# Altium project Rev_2.0.PrjPcb
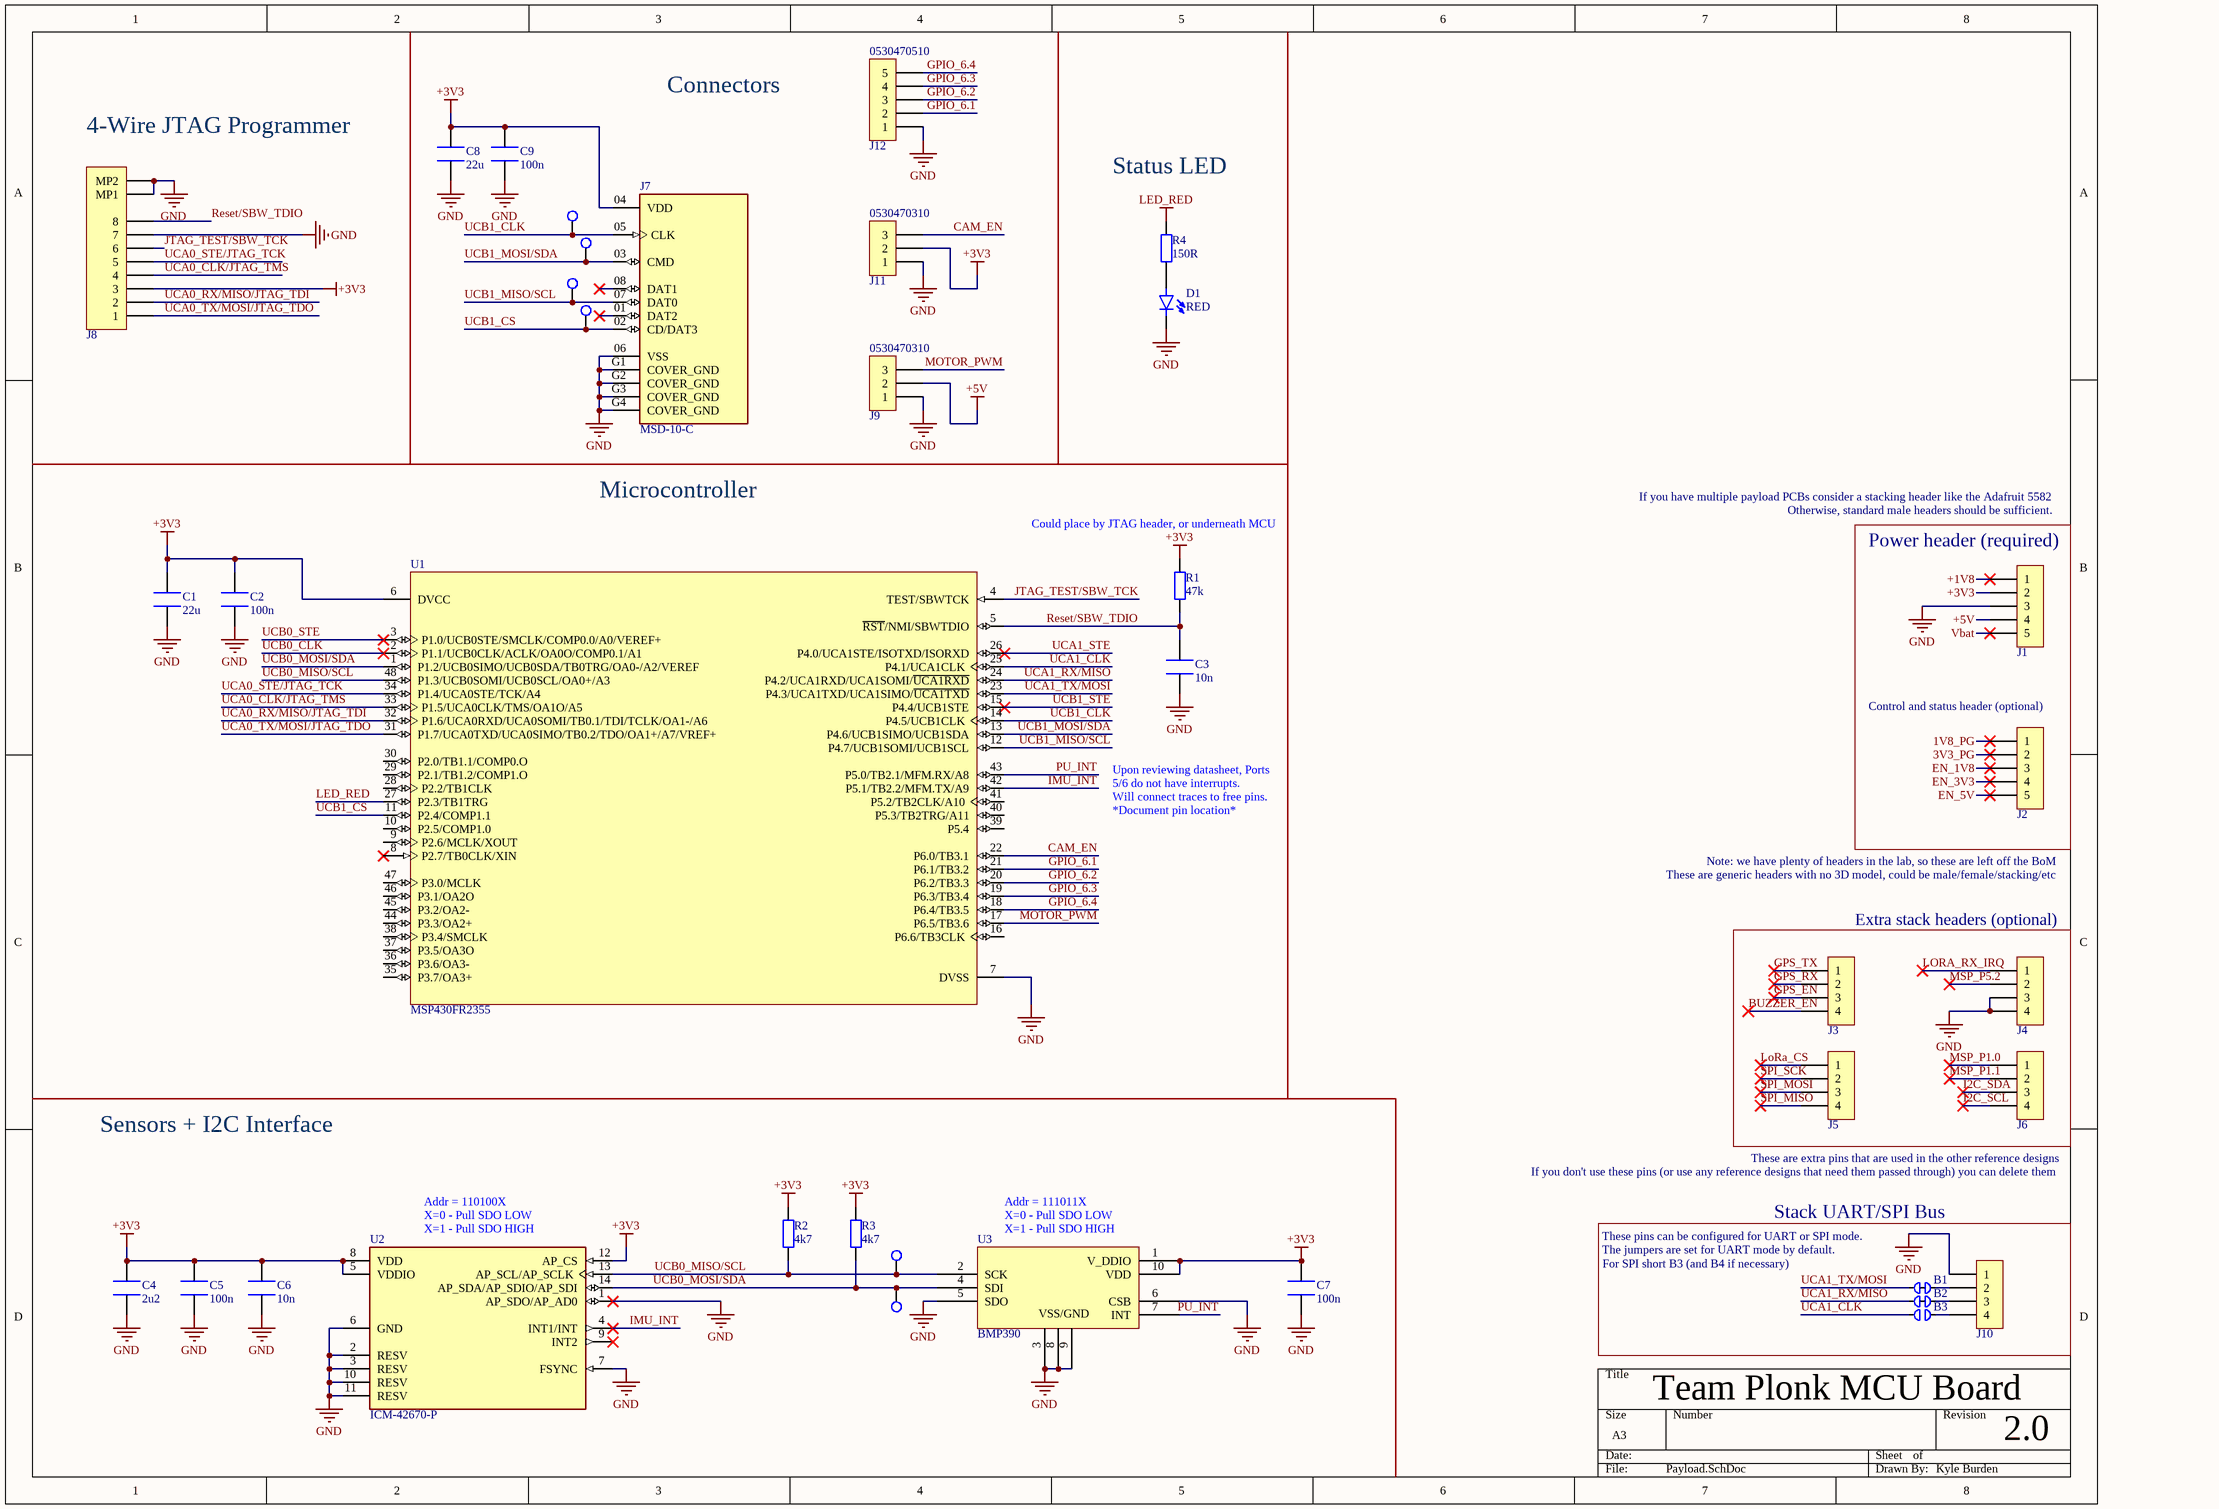
[diagram p0: Payload.SchDoc]
1 sheet, 38 parts. Net scope: global (net labels, ports and power ports of the same name join across sheets).
Board file: Payload.PcbDoc

## Sheet Payload.SchDoc
size A3; SheetNumber: 1; SheetTotal: 1

### Parts
B1  Solder Jumper Normally Closed  [Solder Bridge Chevron 0402 Closed]  (value not drawn)  (net tie, no BOM)
B2  Solder Jumper Normally Closed  [Solder Bridge Chevron 0402 Closed]  (value not drawn)  (net tie, no BOM)
B3  Solder Jumper Normally Open  [Solder Bridge Chevron 0402 Open]  (value not drawn)  (no BOM)
C1  22u  [CAPACITOR_0805_2012M-70N]
C2  100n  [CAPACITOR_0805_2012M-70N]
C3  10n  [CAPACITOR_0805_2012M-70N]
C4  2u2  [CAPACITOR_0805_2012M-70N]
C5  100n  [CAPACITOR_0805_2012M-70N]
C6  10n  [CAPACITOR_0805_2012M-70N]
C7  100n  [CAPACITOR_0805_2012M-70N]
C8  22u  [CAPACITOR_0805_2012M-70N]
C9  100n  [CAPACITOR_0805_2012M-70N]
D1  Colour: RED  [LED_0603_1608M_0.80mm]  (hidden comment: LTST-C190 Series)
J1  Header - 2.54mm,1x5-pin  [HEADER_2.54MM_1x5PIN]  (value not drawn)  (no BOM)
J2  Header - 2.54mm,1x5-pin  [HEADER_2.54MM_1x5PIN]  (value not drawn)  (no BOM)
J3  Header - 2.54mm,1x4-pin  [HEADER_2.54MM_1x4PIN]  (value not drawn)  (no BOM)
J4  Header - 2.54mm,1x4-pin  [HEADER_2.54MM_1x4PIN]  (value not drawn)  (no BOM)
J5  Header - 2.54mm,1x4-pin  [HEADER_2.54MM_1x4PIN]  (value not drawn)  (no BOM)
J6  Header - 2.54mm,1x4-pin  [HEADER_2.54MM_1x4PIN]  (value not drawn)  (no BOM)
J7  MSD-10-C  [MSD-10-C]
J8  0532610871  [MOLEX_0532610871]  (value not drawn)
J9  0530470310  [MOLEX_0530470310]
J10  HDR,2.54mm,1x4  [HEADER_2.54MM_1x4PIN]  (value not drawn)  (no BOM)
J11  0530470310  [MOLEX_0530470310]
J12  0530470510  [MOLEX_0530470510]
R1  47k  [RESISTOR_0805_2012M-50N]
R2  4k7  [RESISTOR_0805_2012M-50N]
R3  4k7  [RESISTOR_0805_2012M-50N]
R4  150R  [Resistor_0805_2012M-50N]
TP1  Test Point  [Test Point Pad Medium]  (value not drawn)  (no BOM)
TP2  Test Point  [Test Point Pad Medium]  (value not drawn)  (no BOM)
TP3  Test Point  [Test Point Pad Medium]  (value not drawn)  (no BOM)
TP4  Test Point  [Test Point Pad Medium]  (value not drawn)  (no BOM)
TP5  Test Point  [Test Point Pad Medium]  (value not drawn)  (no BOM)
TP6  Test Point  [Test Point Pad Medium]  (value not drawn)  (no BOM)
U1  MSP430FR2355  [PT0048A_N]
U2  ICM-42670-P  [XDCR_ICM-42670-P-EXTENDED_PADS]
U3  BMP390  [BMP390]

### Blocks framed on the sheet
Power header (required): J1 J2
Extra stack headers (optional): J3-J6
Stack UART/SPI Bus: B1-B3 J10

### Nets
+3V3: C1.2 C2.2 C4.2 C5.2 C6.2 C7.2 C8.2 C9.2 J1.2 J7.04(VDD) J8.3 J11.2 R1.2 R2.2 R3.2 U1.6(DVCC) U2.5(VDDIO) U2.8(VDD) U2.12(AP_CS) U3.1(V_DDIO) U3.10(VDD)
+5V: J1.4 J9.2
GND: C1.1 C2.1 C3.1 C4.1 C5.1 C6.1 C7.1 C8.1 C9.1 D1.C J1.3 J4.3 J4.4 J7.06(VSS) J7.G1(COVER_GND) J7.G2(COVER_GND) J7.G3(COVER_GND) J7.G4(COVER_GND) J8.7 J8.MP1 J8.MP2 J9.1 J10.1 J11.1 J12.1 U1.7(DVSS) U2.1(AP_SDO/AP_AD0) U2.2(RESV) U2.3(RESV) U2.6(GND) U2.7(FSYNC) U2.10(RESV) U2.11(RESV) U3.3(V_SS/GND) U3.5(SDO) U3.6(CSB) U3.8(V_SS/GND) U3.9(V_SS/GND)
LED_RED: R4.2 U1.27(P2.3/TB1TRG)
1V8_PG: J2.1
3V3_PG: J2.2
+1V8: J1.1
BUZZER_EN: J3.4
CAM_EN: J11.3 U1.22(P6.0/TB3.1)
EN_1V8: J2.3
EN_3V3: J2.4
EN_5V: J2.5
GPIO_6.1: J12.2 U1.21(P6.1/TB3.2)
GPIO_6.2: J12.3 U1.20(P6.2/TB3.3)
GPIO_6.3: J12.4 U1.19(P6.3/TB3.4)
GPIO_6.4: J12.5 U1.18(P6.4/TB3.5)
GPS_EN: J3.3
GPS_RX: J3.2
GPS_TX: J3.1
I2C_SCL: J6.4
I2C_SDA: J6.3
IMU_INT: U1.42(P5.1/TB2.2/MFM.TX/A9) U2.4(INT1/INT)
JTAG_TEST/SBW_TCK: J8.6 U1.4(TEST/SBWTCK)
LoRa_CS: J5.1
LORA_RX_IRQ: J4.1
MOTOR_PWM: J9.3 U1.17(P6.5/TB3.6)
MSP_P1.0: J6.1
MSP_P1.1: J6.2
MSP_P5.2: J4.2
PU_INT: U1.43(P5.0/TB2.1/MFM.RX/A8) U3.7(INT)
Reset/SBW_TDIO: C3.2 J8.8 R1.1 U1.5(~{RST}/NMI/SBWTDIO)
SPI_MISO: J5.4
SPI_MOSI: J5.3
SPI_SCK: J5.2
UCA0_CLK/JTAG_TMS: J8.4 U1.33(P1.5/UCA0CLK/TMS/OA1O/A5)
UCA0_RX/MISO/JTAG_TDI: J8.2 U1.32(P1.6/UCA0RXD/UCA0SOMI/TB0.1/TDI/TCLK/OA1-/A6)
UCA0_STE/JTAG_TCK: J8.5 U1.34(P1.4/UCA0STE/TCK/A4)
UCA0_TX/MOSI/JTAG_TDO: J8.1 U1.31(P1.7/UCA0TXD/UCA0SIMO/TB0.2/TDO/OA1+/A7/VREF+)
UCA1_CLK: B3.1 U1.25(P4.1/UCA1CLK)
UCA1_RX/MISO: B2.1 U1.24(P4.2/UCA1RXD/UCA1SOMI/~{UCA1RXD})
UCA1_STE: U1.26(P4.0/UCA1STE/ISOTXD/ISORXD)
UCA1_TX/MOSI: B1.1 U1.23(P4.3/UCA1TXD/UCA1SIMO/~{UCA1TXD})
UCB0_CLK: U1.2(P1.1/UCB0CLK/ACLK/OA0O/COMP0.1/A1)
UCB0_MISO/SCL: R2.1 TP1.1 U1.48(P1.3/UCB0SOMI/UCB0SCL/OA0+/A3) U2.13(AP_SCL/AP_SCLK) U3.2(SCK)
UCB0_MOSI/SDA: R3.1 TP2.1 U1.1(P1.2/UCB0SIMO/UCB0SDA/TB0TRG/OA0-/A2/VEREF) U2.14(AP_SDA/AP_SDIO/AP_SDI) U3.4(SDI)
UCB0_STE: U1.3(P1.0/UCB0STE/SMCLK/COMP0.0/A0/VEREF+)
UCB1_CLK: J7.05(CLK) TP3.1 U1.14(P4.5/UCB1CLK)
UCB1_CS: J7.02(CD/DAT3) TP6.1 U1.11(P2.4/COMP1.1)
UCB1_MISO/SCL: J7.07(DAT0) TP5.1 U1.12(P4.7/UCB1SOMI/UCB1SCL)
UCB1_MOSI/SDA: J7.03(CMD) TP4.1 U1.13(P4.6/UCB1SIMO/UCB1SDA)
UCB1_STE: U1.15(P4.4/UCB1STE)
Vbat: J1.5
NetB1_2: B1.2 J10.2
NetB2_2: B2.2 J10.3
NetB3_2: B3.2 J10.4
NetD1_A: D1.A R4.1

Not connected (* = marked no-connect by the designer): J7 01(DAT2)* 08(DAT1)*; U1 8(P2.7/TB0CLK/XIN)* 9(P2.6/MCLK/XOUT) 10(P2.5/COMP1.0) 16(P6.6/TB3CLK) 28(P2.2/TB1CLK) 29(P2.1/TB1.2/COMP1.O) 30(P2.0/TB1.1/COMP0.O) 35(P3.7/OA3+) 36(P3.6/OA3-) 37(P3.5/OA3O) 38(P3.4/SMCLK) 39(P5.4) 40(P5.3/TB2TRG/A11) 41(P5.2/TB2CLK/A10) 44(P3.3/OA2+) 45(P3.2/OA2-) 46(P3.1/OA2O) 47(P3.0/MCLK); U2 9(INT2)*

### Notes on the sheet
- Connectors
- (near J8) 4-Wire JTAG Programmer
- Status LED
- Microcontroller
- If you have multiple payload PCBs consider a stacking header like the Adafruit 5582
- Otherwise, standard male headers should be sufficient.
- (near R1) Could place by JTAG header, or underneath MCU
- (near J2) Control and status header (optional)
- Upon reviewing datasheet, Ports 5/6 do not have interrupts.
  Will connect traces to free pins. *Document pin location*
- These are generic headers with no 3D model, could be male/female/stacking/etc
- Note: we have plenty of headers in the lab, so these are left off the BoM
- Sensors + I2C Interface
- If you don't use these pins (or use any reference designs that need them passed through) you can delete them
- These are extra pins that are used in the other reference designs
- (near U2) Addr = 110100X
  X=0 - Pull SDO LOW
  X=1 - Pull SDO HIGH
- (near U3) Addr = 111011X
  X=0 - Pull SDO LOW
  X=1 - Pull SDO HIGH
- These pins can be configured for UART or SPI mode.
- The jumpers are set for UART mode by default.
- For SPI short B3 (and B4 if necessary)
- Team Plonk MCU Board
- 2.0
- Kyle Burden
- Title:
- Design Name:
- Revision:
- Project:
- Date:
- Designer:
- File:
- Time:
- Document Size:
- A4
- (in symbol BMP390) VSS/GND

### Library data of the parts
C1-C9 = Generic Capacitor: Passive - Capacitor, Generic; Tolerance: ?%
  C1 C8: Value: 22u
  C2 C5 C7 C9: Value: 100n
  C3 C6: Value: 10n
  C4: Value: 2u2
D1 = LTST-C190 Series: Diode - LED, 0603; APSS Standard Part: APSS Standard; Temp Range: -30°C ~ 85°C; Rated Voltage: 5V Reverse; Package: 0603; Supplier 1: Digikey
J7 = MSD-10-C: SM Micro SD Card Connector; ComponentLink1Description: Datasheet; ComponentLink1URL: https://www.sameskydevices.com/product/resource/msd-10-c.pdf
J8 = 0532610871: Connector - Picoblade 08-pin, SMT, RA; APSS Standard Part: APSS Standard; Pitch: 1.25mm; Mounting Type: Surface Mount; Orientation: Right Angle; MF Part No.: 0532610871; Pins: 8; Supplier 1: Digikey; Supplier 1 Part No.: WM7626CT-ND
J9 J11 = 0530470310: Connector - Picoblade 03-pin, TH, STR; APSS Standard Part: APSS Standard; Pitch: 1.25mm; Mounting Type: Through-hole; Orientation: Straight; MF Part No.: 0530470310; Pins: 3; Supplier 1: Digikey; Supplier 1 Part No.: WM1732-ND
J10 = HDR,2.54mm,1x4: Connector - 2.54mm, 1x4-pin
J12 = 0530470510: Connector - Picoblade 05-pin, TH, STR; APSS Standard Part: APSS Standard; Pitch: 1.25mm; Mounting Type: Through-hole; Orientation: Straight; MF Part No.: 0530470510; Pins: 5; Supplier 1: Digikey; Supplier 1 Part No.: WM1734-ND
R1-R3 = Generic Resistor: Passive - Resistor, Generic; Tolerance: ?%
  R1: Value: 47k
  R2 R3: Value: 4k7
R4 = RES SM 0805: 0805 Surface Mount Resistor
U1 = MSP430FR2355: 24-MHz 105-C integrated analog microcontroller with 32-KB FRAM, Op-Amps/PGAs, 12-bit DACs, 12-bit AD; ComponentLink1Description: Datasheet; ComponentLink1URL: https://www.ti.com/lit/ds/symlink/msp430fr2355.pdf?HQS=dis-dk-null-digikeymode-dsf-pf-null-wwe&ts=1766128428387&ref_url=https%253A%252F%252Fwww.ti.com%252Fgeneral%252Fdocs%252Fsuppproductinfo.tsp%253FdistId%253D10%2526gotoUrl%253Dhttps%253A%252F%252Fwww.ti.com%252Flit%252Fgpn%252Fmsp430fr2355
U2 = ICM-42670-P: IC - Inertial Management Unit: Accelerometer + Gyro + Temperature Sensor, 6 Axis, I2C / I3C / SPI Interfaces; APSS Standard Part: APSS Standard; Rated Voltage: 3.6V; Temp Range: -40°C ~ 85°C; Package: 14-LGA; MF Part No.: ICM-42670-P; Supplier 1: Digikey; Supplier 1 Part No.: 1428-ICM-42670-PCT-ND
U3 = BMP390: Pressure Sensor; ComponentLink1Description: Datasheet; ComponentLink1URL: https://www.bosch-sensortec.com/products/environmental-sensors/pressure-sensors/bmp390/
B1 B2 = Solder Jumper Normally Closed: DEBUG: DEBUG
B3 = Solder Jumper Normally Open: DEBUG: DEBUG